# Altium project EN-C200_RA0.PrjPCB
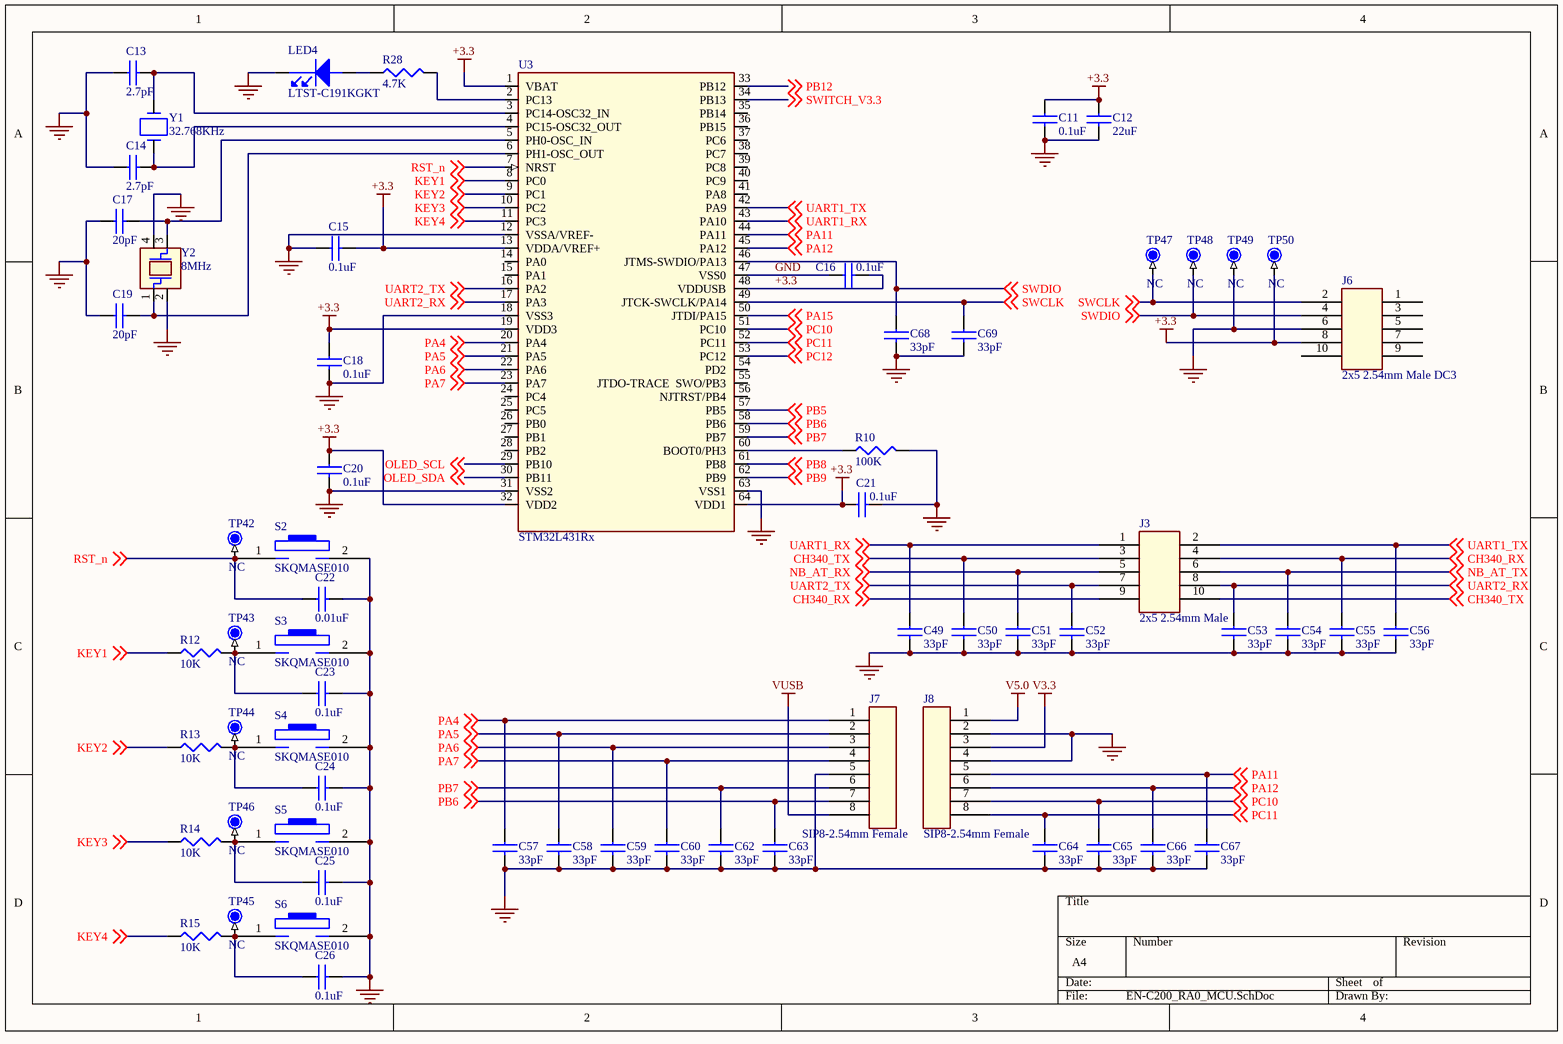
[diagram p0: EN-C200_RA0_MCU.SchDoc]
3 sheets, 120 parts. Net scope: global (net labels, ports and power ports of the same name join across sheets).
Sheets:
  EN-C200_RA0_MCU.SchDoc
  EN-C200_RA0_OLED.SchDoc
  EN-C200_RA0_PWR.SchDoc

## Sheet EN-C200_RA0_MCU.SchDoc: STM32L433
size A4; DocumentNumber: EN-C200

### Parts
C11  0.1uF  [SC0603]
C12  22uF  [SC0805]
C13  2.7pF  [SC0603]
C14  2.7pF  [SC0603]
C15  0.1uF  [SC0603]
C16  0.1uF  [SC0603]
C17  20pF  [SC0603]
C18  0.1uF  [SC0603]
C19  20pF  [SC0603]
C20  0.1uF  [SC0603]
C21  0.1uF  [SC0603]
C22  0.01uF  [SC0603]
C23  0.1uF  [SC0603]
C24  0.1uF  [SC0603]
C25  0.1uF  [SC0603]
C26  0.1uF  [SC0603]
C49  33pF  [SC0603]
C50  33pF  [SC0603]
C51  33pF  [SC0603]
C52  33pF  [SC0603]
C53  33pF  [SC0603]
C54  33pF  [SC0603]
C55  33pF  [SC0603]
C56  33pF  [SC0603]
C57  33pF  [SC0603]
C58  33pF  [SC0603]
C59  33pF  [SC0603]
C60  33pF  [SC0603]
C62  33pF  [SC0603]
C63  33pF  [SC0603]
C64  33pF  [SC0603]
C65  33pF  [SC0603]
C66  33pF  [SC0603]
C67  33pF  [SC0603]
C68  33pF  [SC0603]
C69  33pF  [SC0603]
J3  2x5 2.54mm Male  [SIP-2X5P-100]
J6  2x5 2.54mm Male DC3  [SIP-2X5P-100-DS]
J7  SIP8-2.54mm Female  [SIP-8P-100]
J8  SIP8-2.54mm Female  [SIP-8P-100]
LED4  LTST-C191KGKT  [HSD0603-LED]
R10  100K  [SR0603]
R12  10K  [SR0603]
R13  10K  [SR0603]
R14  10K  [SR0603]
R15  10K  [SR0603]
R28  4.7K  [SR0603]
S2  SKQMASE010  [SW2-240X140]
S3  SKQMASE010  [SW2-240X140]
S4  SKQMASE010  [SW2-240X140]
S5  SKQMASE010  [SW2-240X140]
S6  SKQMASE010  [SW2-240X140]
TP42  NC  [TP32-SMD]
TP43  NC  [TP32-SMD]
TP44  NC  [TP32-SMD]
TP45  NC  [TP32-SMD]
TP46  NC  [TP32-SMD]
TP47  NC  [TP32-SMD]
TP48  NC  [TP32-SMD]
TP49  NC  [TP32-SMD]
TP50  NC  [TP32-SMD]
U3  STM32L431Rx  [QFP64D-050-1010L]
Y1  32.768KHz  [FC-135_110]
Y2  8MHz  [HSX4-0503B]

### Nets
+3.3: C11.1 C12.1 C15.2 C16.2 C18.1 C20.1 C21.1 J6.8 TP50.1 U3.1(VBAT) U3.13(VDDA/VREF+) U3.19(VDD3) U3.32(VDD2) U3.48(VDDUSB) U3.64(VDD1)
GND: C11.2 C12.2 C13.1 C14.1 C15.1 C16.1 C17.1 C18.2 C19.1 C20.2 C21.2 C22.2 C23.2 C24.2 C25.2 C26.2 C49.2 C50.2 C51.2 C52.2 C53.2 C54.2 C55.2 C56.2 C57.2 C58.2 C59.2 C60.2 C62.2 C63.2 C64.2 C65.2 C66.2 C67.2 C68.2 C69.2 J6.6 J7.5 J8.2 J8.4 LED4.2 R10.2 S2.2(B) S3.2(B) S4.2(B) S5.2(B) S6.2(B) TP49.1 U3.12(VSSA/VREF-) U3.18(VSS3) U3.31(VSS2) U3.47(VSS0) U3.63(VSS1) Y2.2 Y2.4
V3.3: J8.3
V5.0: J8.1
VUSB: J7.8
CH340_RX: C55.1 J3.4 J3.9 ; off-sheet CH340_RX
CH340_TX: C50.1 J3.3 J3.10 ; off-sheet CH340_TX
KEY1: R12.1 U3.8(PC0) ; off-sheet KEY1
KEY2: R13.1 U3.9(PC1) ; off-sheet KEY2
KEY3: R14.1 U3.10(PC2) ; off-sheet KEY3
KEY4: R15.1 U3.11(PC3) ; off-sheet KEY4
NB_AT_RX: C51.1 J3.5 ; off-sheet NB_AT_RX
NB_AT_TX: C54.1 J3.6 ; off-sheet NB_AT_TX
OLED_SCL: U3.29(PB10) ; off-sheet OLED_SCL
OLED_SDA: U3.30(PB11) ; off-sheet OLED_SDA
PA4: C57.1 J7.1 U3.20(PA4) ; off-sheet PA4
PA5: C58.1 J7.2 U3.21(PA5) ; off-sheet PA5
PA6: C59.1 J7.3 U3.22(PA6) ; off-sheet PA6
PA7: C60.1 J7.4 U3.23(PA7) ; off-sheet PA7
PA11: C67.1 J8.5 U3.44(PA11) ; off-sheet PA11
PA12: C66.1 J8.6 U3.45(PA12) ; off-sheet PA12
PA15: U3.50(JTDI/PA15) ; off-sheet PA15
PB5: U3.57(PB5) ; off-sheet PB5
PB6: C63.1 J7.7 U3.58(PB6) ; off-sheet PB6
PB7: C62.1 J7.6 U3.59(PB7) ; off-sheet PB7
PB8: U3.61(PB8) ; off-sheet PB8
PB9: U3.62(PB9) ; off-sheet PB9
PB12: U3.33(PB12) ; off-sheet PB12
PC10: C65.1 J8.7 U3.51(PC10) ; off-sheet PC10
PC11: C64.1 J8.8 U3.52(PC11) ; off-sheet PC11
PC12: U3.53(PC12) ; off-sheet PC12
RST_n: C22.1 S2.1(A) TP42.1 U3.7(NRST) ; off-sheet RST_n
SWCLK: C69.1 J6.2 TP47.1 U3.49(JTCK-SWCLK/PA14) ; off-sheet SWCLK
SWDIO: C68.1 J6.4 TP48.1 U3.46(JTMS-SWDIO/PA13) ; off-sheet SWDIO
SWITCH_V3.3: U3.34(PB13) ; off-sheet SWITCH_V3.3
UART1_RX: C49.1 J3.1 U3.43(PA10) ; off-sheet UART1_RX
UART1_TX: C56.1 J3.2 U3.42(PA9) ; off-sheet UART1_TX
UART2_RX: C53.1 J3.8 U3.17(PA3) ; off-sheet UART2_RX
UART2_TX: C52.1 J3.7 U3.16(PA2) ; off-sheet UART2_TX
NetC13_2: C13.2 U3.3(PC14-OSC32_IN) Y1.2
NetC14_2: C14.2 U3.4(PC15-OSC32_OUT) Y1.1
NetC17_2: C17.2 U3.5(PH0-OSC_IN) Y2.3(COUT)
NetC19_2: C19.2 U3.6(PH1-OSC_OUT) Y2.1(CIN)
NetC23_1: C23.1 R12.2 S3.1(A) TP43.1
NetC24_1: C24.1 R13.2 S4.1(A) TP44.1
NetC25_1: C25.1 R14.2 S5.1(A) TP46.1
NetC26_1: C26.1 R15.2 S6.1(A) TP45.1
NetLED4_1: LED4.1 R28.1
NetR10_1: R10.1 U3.60(BOOT0/PH3)
NetR28_2: R28.2 U3.2(PC13)

Not connected (* = marked no-connect by the designer): J6 1 3 5 7 9 10; U3 14(PA0) 15(PA1) 24(PC4) 25(PC5) 26(PB0) 27(PB1) 28(PB2) 35(PB14) 36(PB15) 37(PC6) 38(PC7) 39(PC8) 40(PC9) 41(PA8) 54(PD2) 55(JTDO-TRACE__SWO/PB3) 56(NJTRST/PB4)

### Library data of the parts
C11-C26 C49-C60 C62-C69 = CAP NP
J3 J6 = CON10A
J7 J8 = HEADER8
LED4 = LED
R10 R12-R15 R28 = RESISTOR
S2-S6 = PUSH-KEY
TP42-TP50 = TP
Y1 = CRYSTAL2P
Y2 = CRYSTAL4P

## Sheet EN-C200_RA0_OLED.SchDoc
size A4
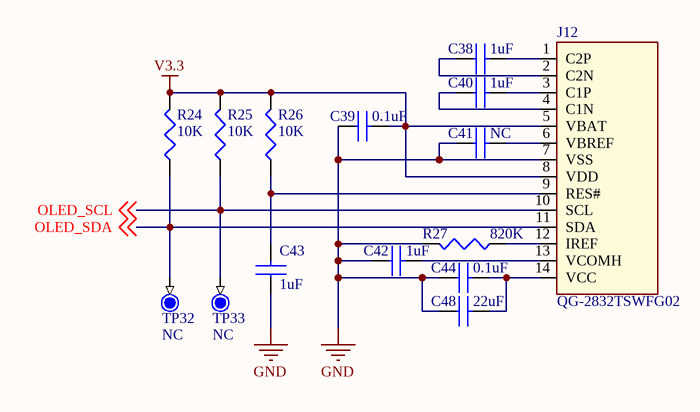
[diagram p1: EN-C200_RA0_OLED.SchDoc]

### Parts
C38  1uF  [SC0603]
C39  0.1uF  [SC0603]
C40  1uF  [SC0603]
C41  NC  [SC0603]
C42  1uF  [SC0603]
C43  1uF  [SC0603]
C44  0.1uF  [SC0603]
C48  22uF  [SC0805]
J12  QG-2832TSWFG02  [FPC14-25]
R24  10K  [SR0603]
R25  10K  [SR0603]
R26  10K  [SR0603]
R27  820K  [SR0603]
TP32  NC  [TP32-SMD]
TP33  NC  [TP32-SMD]

### Nets
GND: C39.1 C41.1 C42.1 C43.1 C44.1 C48.1 J12.7(VSS) R27.2
V3.3: C39.2 J12.5(VBAT) J12.8(VDD) R24.2 R25.2 R26.2
OLED_SCL: J12.10(SCL) R25.1 TP33.1 ; off-sheet OLED_SCL
OLED_SDA: J12.11(SDA) R24.1 TP32.1 ; off-sheet OLED_SDA
NetC38_1: C38.1 J12.2(C2N)
NetC38_2: C38.2 J12.1(C2P)
NetC40_1: C40.1 J12.4(C1N)
NetC40_2: C40.2 J12.3(C1P)
NetC41_2: C41.2 J12.6(VBREF)
NetC42_2: C42.2 J12.13(VCOMH)
NetC43_2: C43.2 J12.9(RES#) R26.1
NetC44_2: C44.2 C48.2 J12.14(VCC)
NetJ12_12: J12.12(IREF) R27.1

### Library data of the parts
C38-C44 C48 = CAP NP
J12 = OLED_0.91
R24-R27 = RESISTOR
TP32 TP33 = TP

## Sheet EN-C200_RA0_PWR.SchDoc
size A4
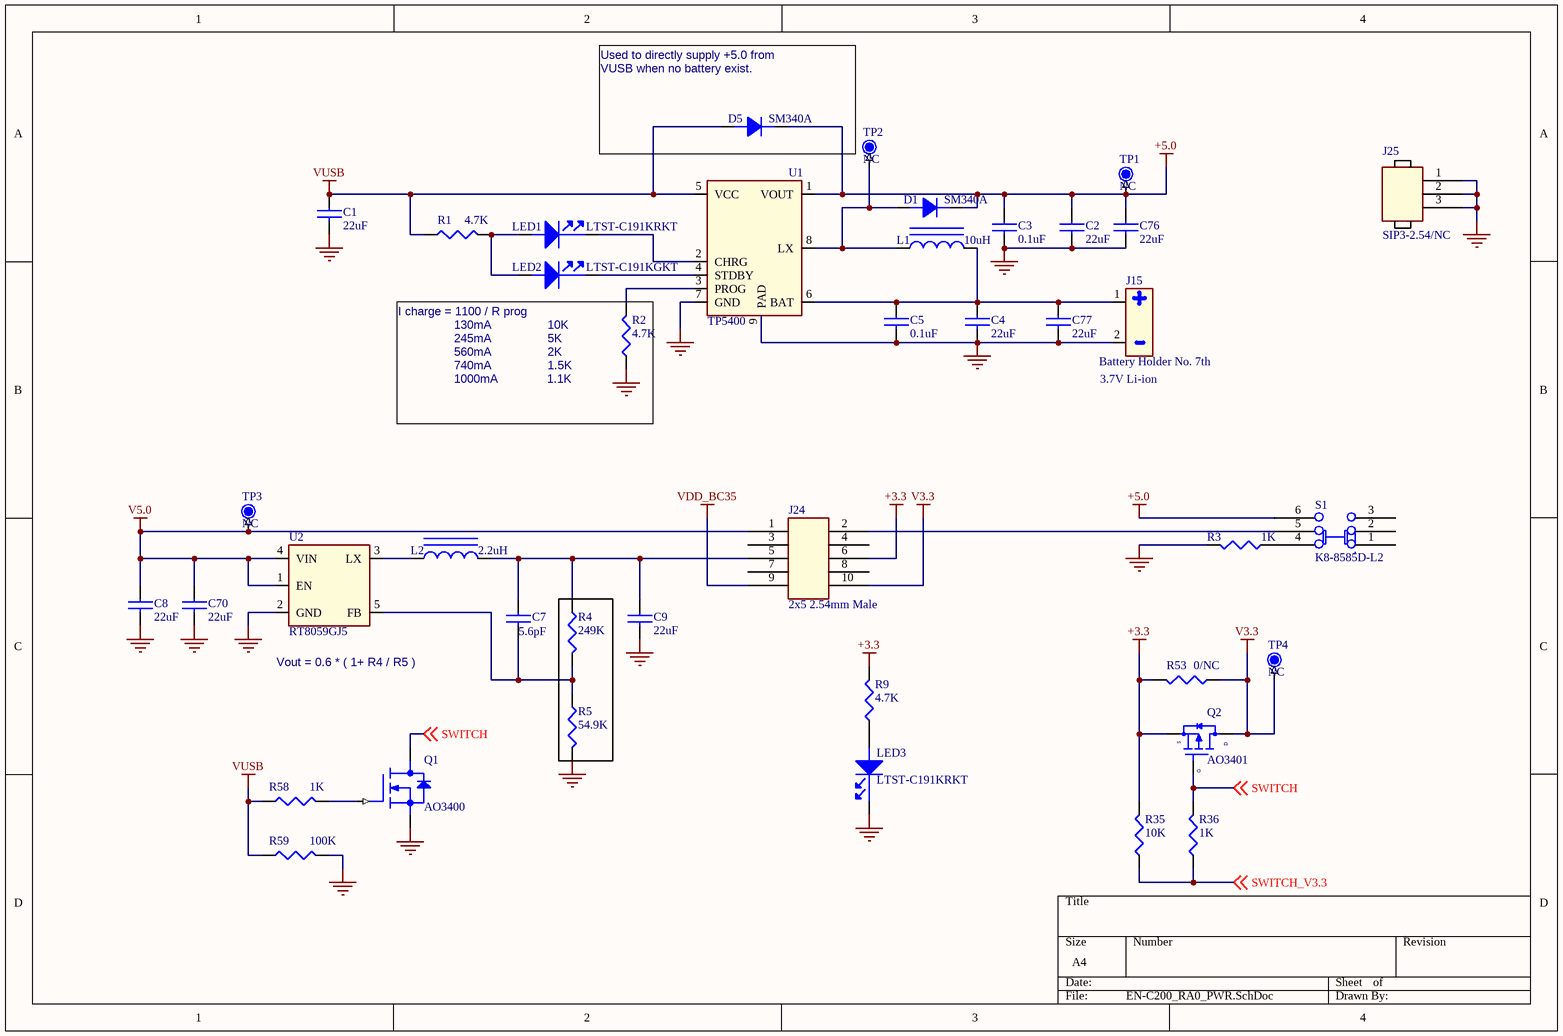
[diagram p2: EN-C200_RA0_PWR.SchDoc]

### Parts
C1  22uF  [SC0805]
C2  22uF  [SC0805]
C3  0.1uF  [SC0603]
C4  22uF  [SC0805]
C5  0.1uF  [SC0603]
C7  5.6pF  [SC0603]
C8  22uF  [SC0805]
C9  22uF  [SC0805]
C70  22uF  [SC0805]
C76  22uF  [SC0805]
C77  22uF  [SC0805]
D1  SM340A  [SD1714]
D5  SM340A  [SD1714]
J15  Battery Holder No. 7th  [BX0034]
J24  2x5 2.54mm Male  [SIP-2X5P-100]
J25  SIP3-2.54/NC  [SIP-3P]
L1  10uH  [SPL0505B]
L2  2.2uH  [SL1008]
LED1  LTST-C191KRKT  [HSD0603-LED]
LED2  LTST-C191KGKT  [HSD0603-LED]
LED3  LTST-C191KRKT  [HSD0603-LED]
Q1  AO3400  [SOT23]
Q2  AO3401  [SOT23]
R1  4.7K  [SR0603]
R2  4.7K  [SR0603]
R3  1K  [SR0603]
R4  249K  [SR0603]
R5  54.9K  [SR0603]
R9  4.7K  [SR0603]
R35  10K  [SR0603]
R36  1K  [SR0603]
R53  0/NC  [SR0603]
R58  1K  [SR0603]
R59  100K  [SR0603]
S1  K8-8585D-L2  [SW2X3-100]
TP1  NC  [TP32-SMD]
TP2  NC  [TP32-SMD]
TP3  NC  [TP32-SMD]
TP4  NC  [TP32-SMD]
U1  TP5400  [SOP8-50-150B]
U2  RT8059GJ5  [SOT23-5]

### Nets
+3.3: J24.6 Q2.2(S) R9.2 R35.2 R53.2
+5.0: C2.1 C3.1 C76.1 D1.2(K) D5.2(K) S1.6 TP1.1 U1.1(VOUT)
GND: C1.2 C2.2 C3.2 C4.2 C5.2 C8.2 C9.2 C70.2 C76.2 C77.2 J15.2 J25.1 J25.2 J25.3 LED3.2 Q1.2(S) R2.1 R3.2 R5.2 R59.2 U1.7(GND) U1.9(PAD) U2.2(GND)
V3.3: J24.10 Q2.3(D) R53.1 TP4.1
V5.0: C8.1 C70.1 J24.1 TP3.1 U2.1(EN) U2.4(VIN)
VDD_BC35: J24.9
VUSB: C1.1 D5.1(A) R1.1 R58.1 R59.1 U1.5(VCC)
SWITCH: Q1.3(D) Q2.1(G) R36.2 ; off-sheet SWITCH
SWITCH_V3.3: R35.1 R36.1 ; off-sheet SWITCH_V3.3
NetC4_1: C4.1 C5.1 C77.1 J15.1 L1.2 U1.6(BAT)
NetC7_1: C7.1 C9.1 J24.5 L2.2 R4.1
NetC7_2: C7.2 R4.2 R5.1 U2.5(FB)
NetD1_1: D1.1(A) L1.1 TP2.1 U1.8(LX)
NetJ24_2: J24.2 S1.5
NetL2_1: L2.1 U2.3(LX)
NetLED1_1: LED1.1 LED2.1 R1.2
NetLED1_2: LED1.2 U1.2(CHRG)
NetLED2_2: LED2.2 U1.4(STDBY)
NetLED3_1: LED3.1 R9.1
NetQ1_1: Q1.1(G) R58.2
NetR2_2: R2.2 U1.3(PROG)
NetR3_1: R3.1 S1.4

Not connected (* = marked no-connect by the designer): J24 3 4 7 8; S1 1 2 3

### Notes on the sheet
- (near D5) Used to directly supply +5.0 from
  VUSB when no battery exist.
- (near J15) 3.7V Li-ion
- (near R2) I charge = 1100 / R prog
  130mA                10K
  245mA                5K
  560mA                2K
  740mA                1.5K
  1000mA              1.1K
- Vout = 0.6 * ( 1+ R4 / R5 )

### Library data of the parts
C1-C5 C7-C9 C70 C76 C77 = CAP NP
D1 D5 = DIODE
J15 = BX0034
J24 = CON10A
J25 = HEADER3
L1 L2 = TOROID IRON
LED1-LED3 = LED
Q1 = MPF6661
Q2 = A03401
R1-R5 R9 R35 R36 R53 R58 R59 = RESISTOR
S1 = SW_PUSH6: SDTSourceLibName: C:\WIND95\TEMP\6200.LIB
TP1-TP4 = TP
U2 = RT8059

## Nets that join several sheets
+3.3: EN-C200_RA0_MCU (15 pins), EN-C200_RA0_PWR (5 pins)
GND: EN-C200_RA0_MCU (55 pins), EN-C200_RA0_OLED (8 pins), EN-C200_RA0_PWR (23 pins)
V3.3: EN-C200_RA0_MCU (J8.3), EN-C200_RA0_OLED (6 pins), EN-C200_RA0_PWR (J24.10 Q2.3 R53.1 TP4.1)
V5.0: EN-C200_RA0_MCU (J8.1), EN-C200_RA0_PWR (6 pins)
VUSB: EN-C200_RA0_MCU (J7.8), EN-C200_RA0_PWR (6 pins)
OLED_SCL: EN-C200_RA0_MCU (U3.29), EN-C200_RA0_OLED (J12.10 R25.1 TP33.1)
OLED_SDA: EN-C200_RA0_MCU (U3.30), EN-C200_RA0_OLED (J12.11 R24.1 TP32.1)
SWITCH_V3.3: EN-C200_RA0_MCU (U3.34), EN-C200_RA0_PWR (R35.1 R36.1)